# EAGLE design circuit (EAGLE 9.0.0)
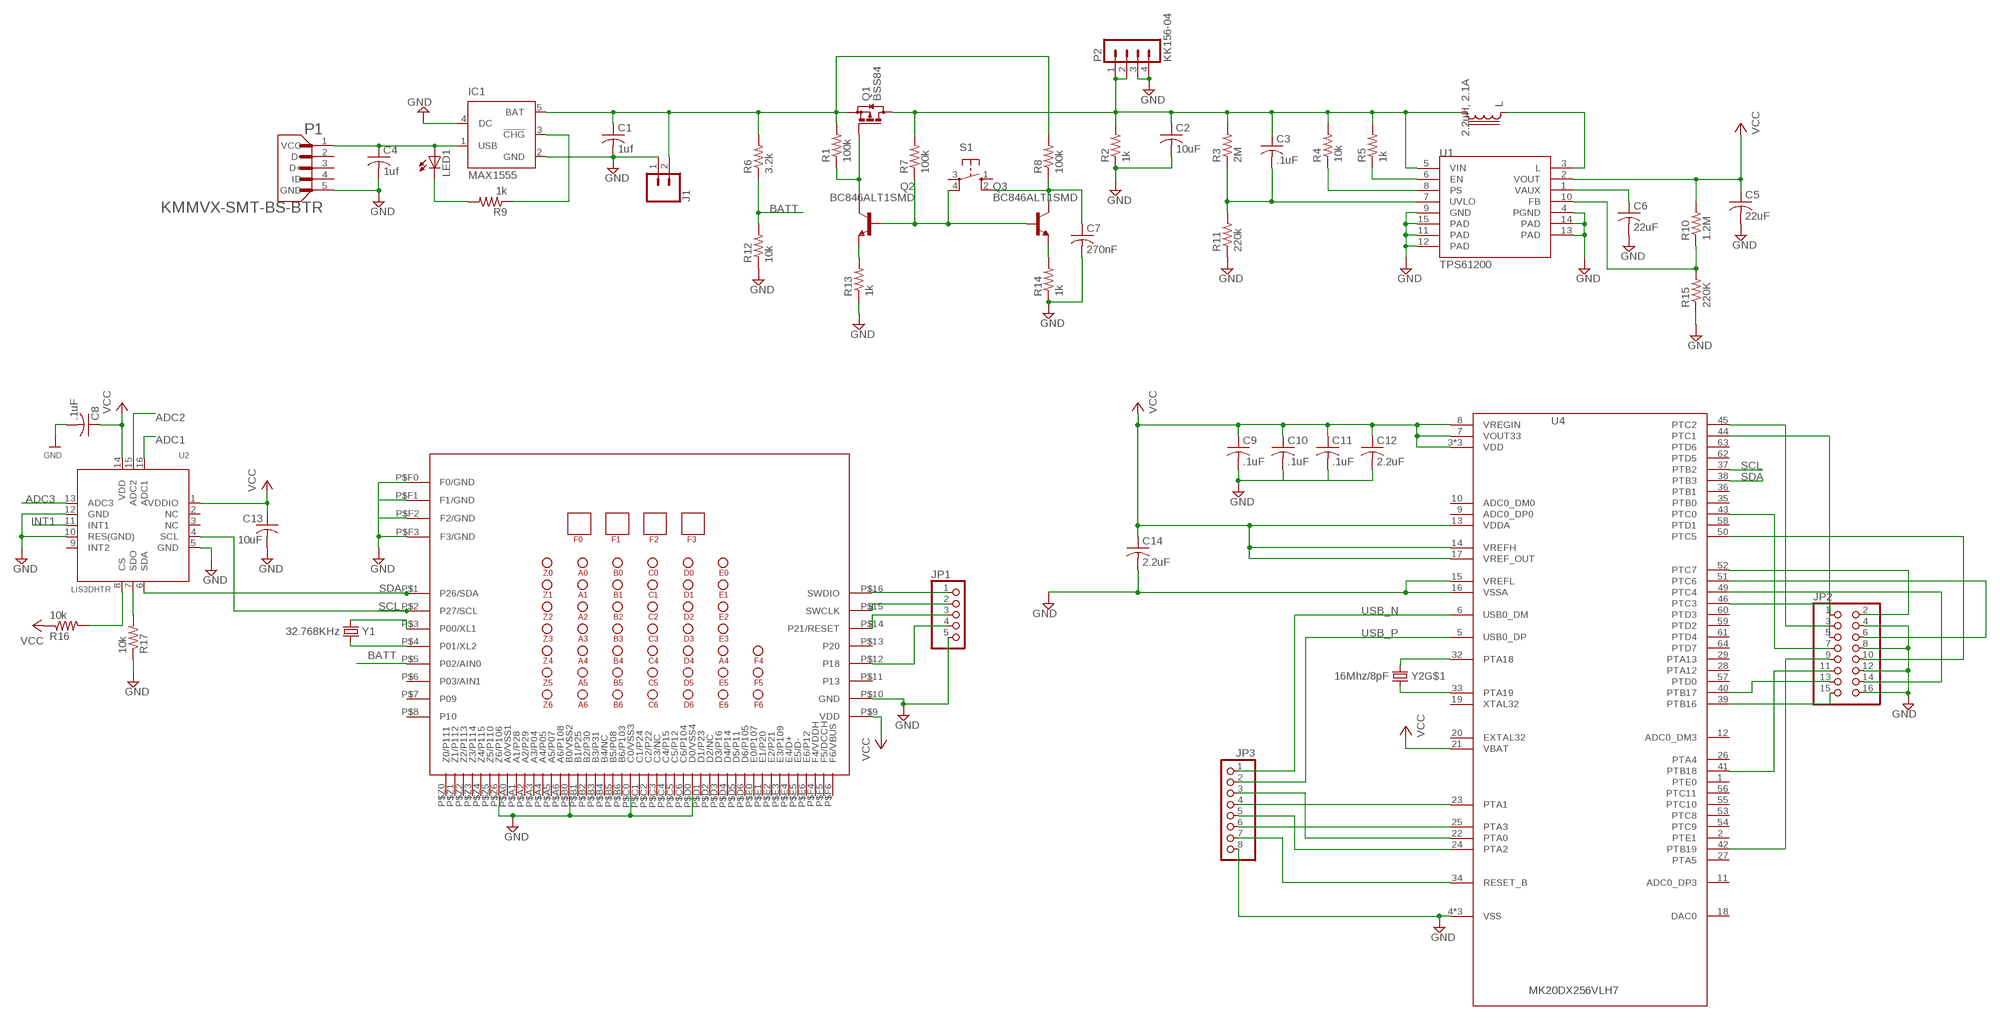
[diagram p0: schematic, sheet 1]

## Parts
C1  1uf  C-USC0402  [C0402]
C2  10uF  C-USC0402  [C0402]
C3  .1uF  C-USC0402  [C0402]
C4  1uf  C-USC0402  [C0402]
C5  22uF  C-USC0402  [C0402]
C6  22uF  C-USC0402  [C0402]
C7  270nF  C-USC0402  [C0402]
C8  .1uF  C-USC0402  [C0402]
C9  .1uF  C-USC0402  [C0402]
C10  .1uF  C-USC0402  [C0402]
C11  .1uF  C-USC0402  [C0402]
C12  2.2uF  C-USC0402  [C0402]
C13  10uF  C-USC0402  [C0402]
C14  2.2uF  C-USC0402  [C0402]
IC1  MAX1555  [SOT23-5L]
J1  CONN_02-JST-2-PTH-NO_SILK  [JST-2-PTH-NS]
JP1  PINHD-1X5  [1X05]
JP2  PINHD-2X8  [2X08]
JP3  PINHD-1X8  [1X08]
L  2.2uH, 2.1A  LPS30152.2UH  [LPS3015]
LED1  LEDSML0805  [SML0805]
P1  KMMVX-SMT-BS-BTR  [KYCON_KMMVX-SMT-BS-BTR]
P2  KK156-04  [KK156-04]
Q1  BSS84  [SOT23]
Q2  BC846ALT1SMD  [SOT23]
Q3  BC846ALT1SMD  [SOT23]
R1  100k  R-US_R0402  [R0402]
R2  1k  R-US_R0402  [R0402]
R3  2M  R-US_R0402  [R0402]
R4  10k  R-US_R0402  [R0402]
R5  1k  R-US_R0402  [R0402]
R6  3.2k  R-US_R0402  [R0402]
R7  100k  R-US_R0402  [R0402]
R8  100k  R-US_R0402  [R0402]
R9  1k  R-US_R0402  [R0402]
R10  1.2M  R-US_R0402  [R0402]
R11  220k  R-US_R0402  [R0402]
R12  10k  R-US_R0402  [R0402]
R13  1k  R-US_R0402  [R0402]
R14  1k  R-US_R0402  [R0402]
R15  220K  R-US_R0402  [R0402]
R16  10k  R-US_R0402  [R0402]
R17  10k  R-US_R0402  [R0402]
S1  10-XX  [B3F-10XX]
U1  TPS61200  [QFN-10_PAD]
U2  LIS3DHTR  ACCEL_LIS3DHTR  [LGA16_3X3MM]
U3  BT840  [BT840]
U4  MK20DX256VLH7  [MK20DX256VLH7]
Y1  32.768KHz  CRYSTAL/32.768KHZ/SMD-TXC_7A  [CRYSTAL-TXC-7A]
Y2  16Mhz/8pF  CRYSTAL/SMD-5X3-GND16MHZ/8PF  [CRYSTAL-SMD-5X3]

## Nets
ADC1: U2.16(ADC1)
ADC2: U2.15(ADC2)
ADC3: U2.13(ADC3)
BATT: R6.1 R12.2 U3.P$5(P02/AIN0)
GND: C1.2 C2.2 C4.2 C5.2 C6.2 C7.2 C8.2 C9.2 C10.2 C13.2 C14.2 IC1.2(GND) IC1.4(DC) J1.1 JP1.5 JP2.4 JP2.8 JP2.12 JP2.16 JP3.8 P1.5(GND) P2.3 P2.4 R2.1 R11.1 R12.1 R13.1 R14.1 R15.1 R17.1 U1.4(PGND) U1.9(GND) U1.11(PAD) U1.12(PAD) U1.13(PAD) U1.14(PAD) U1.15(PAD) U2.5(GND) U2.10(RES(GND)) U2.12(GND) U3.P$10(GND) U3.P$B0(B0/VSS2) U3.P$C0(C0/VSS3) U3.P$D0(D0/VSS4) U3.P$F0(F0/GND) U3.P$F1(F1/GND) U3.P$F2(F2/GND) U3.P$F3(F3/GND) U3.P$Z6(Z6/P106) U4.4(VSS) U4.15(VREFL) U4.16(VSSA) U4.31(VSS) U4.47(VSS)
GND1: C11.2
GND2: C12.2
INT1: U2.11(INT1)
N$1: Q1.1(G) Q2.3(C) R1.1
N$2: C7.1 Q3.3(C) R8.1 S1.2(S1)
N$3: Q2.2(E) R13.2
N$4: Q2.1(B) Q3.1(B) R7.1 S1.4(P1)
N$5: Q3.2(E) R14.2
N$6: JP2.1 U4.46(PTC3)
N$7: U3.P$3(P00/XL1) Y1.P$2
N$8: C4.1 IC1.1(USB) LED1.A P1.1(VCC)
N$9: R16.2 U2.8(CS)
N$10: IC1.3(!CHG) R9.1
N$11: LED1.C R9.2
N$12: R17.2 U2.7(SDO)
N$13: L.1 U1.3(L)
N$14: JP3.3 U4.22(PTA0)
N$15: U3.P$4(P01/XL2) Y1.P$1
N$16: C3.2 R3.1 R11.2 U1.7(UVLO)
N$17: R4.1 U1.8(PS)
N$18: JP3.4 U4.23(PTA1)
N$19: R5.1 U1.6(EN)
N$20: C6.1 U1.1(VAUX)
N$21: JP3.5 U4.24(PTA2)
N$22: R10.1 R15.2 U1.10(FB)
N$23: JP3.6 U4.25(PTA3)
N$24: JP3.7 U4.34(RESET_B)
N$25: JP1.1 U3.P$16(SWDIO)
N$26: JP1.2 U3.P$15(SWCLK)
N$27: U4.32(PTA18) Y2.3
N$28: U4.33(PTA19) Y2.1
N$29: JP1.3 U3.P$14(P21/RESET)
N$30: JP1.4 U3.P$12(P18)
N$31: C1.1 IC1.5(BAT) J1.2 Q1.2(S) R1.2 R6.2 R8.2
N$32: JP2.3 U4.45(PTC2)
N$33: JP2.5 U4.44(PTC1)
N$34: JP2.7 U4.43(PTC0)
N$35: JP2.9 U4.42(PTB19)
N$36: JP2.11 U4.41(PTB18)
N$37: JP2.13 U4.40(PTB17)
N$38: JP2.15 U4.39(PTB16)
N$39: JP2.14 U4.49(PTC4)
N$40: JP2.10 U4.50(PTC5)
N$41: JP2.6 U4.51(PTC6)
N$42: JP2.2 U4.52(PTC7)
SCL: U2.4(SCL) U3.P$2(P27/SCL) U4.37(PTB2)
SDA: U2.6(SDA) U3.P$1(P26/SDA) U4.38(PTB3)
USB_N: JP3.1 U4.6(USB0_DM)
USB_P: JP3.2 U4.5(USB0_DP)
VCC: C5.1 C8.1 C9.1 C10.1 C11.1 C12.1 C13.1 C14.1 R10.2 R16.1 U1.2(VOUT) U2.1(VDDIO) U2.14(VDD) U3.P$9(VDD) U4.3(VDD) U4.7(VOUT33) U4.8(VREGIN) U4.13(VDDA) U4.14(VREFH) U4.17(VREF_OUT) U4.21(VBAT) U4.30(VDD) U4.48(VDD)
VIN: C2.1 C3.1 L.2 P2.1 P2.2 Q1.3(D) R2.2 R3.2 R4.2 R5.2 R7.2 U1.5(VIN)
Unconnected: P1.2(D-) P1.3(D+) P1.4(ID) S1.1(S) S1.3(P) U2.2(NC) U2.3(NC) U2.9(INT2) U3.P$6(P03/AIN1) U3.P$7(P09) U3.P$8(P10) U3.P$11(P13) U3.P$13(P20) U3.P$A0(A0/VSS1) U3.P$A1(A1/P28) U3.P$A2(A2/P29) U3.P$A3(A3/P04) U3.P$A4(A4/P05) U3.P$A5(A5/P07) U3.P$A6(A6/P108) U3.P$B1(B1/P25) U3.P$B2(B2/P30) U3.P$B3(B3/P31) U3.P$B4(B4/NC) U3.P$B5(B5/P08) U3.P$B6(B6/P103) U3.P$C1(C1/P24) U3.P$C2(C2/P22) U3.P$C3(C3/NC) U3.P$C4(C4/P15) U3.P$C5(C5/P12) U3.P$C6(C6/P104) U3.P$D1(D1/P23) U3.P$D2(D2/NC) U3.P$D3(D3/P16) U3.P$D4(D4/P14) U3.P$D5(D5/P11) U3.P$D6(D6/P105) U3.P$E0(E0/P107) U3.P$E1(E1/P20) U3.P$E2(E2/P21) U3.P$E3(E3/P109) U3.P$E4(E4/D+) U3.P$E5(E5/D-) U3.P$E6(E6/P12) U3.P$F4(F4/VDDH) U3.P$F5(F5/DCCH) U3.P$F6(F6/VBUS) U3.P$Z0(Z0/P111) U3.P$Z1(Z1/P112) U3.P$Z2(Z2/P113) U3.P$Z3(Z3/P114) U3.P$Z4(Z4/P115) U3.P$Z5(Z5/P110) U4.1(PTE0) U4.2(PTE1) U4.9(ADC0_DP0) U4.10(ADC0_DM0) U4.11(ADC0_DP3) U4.12(ADC0_DM3) U4.18(DAC0) U4.19(XTAL32) U4.20(EXTAL32) U4.26(PTA4) U4.27(PTA5) U4.28(PTA12) U4.29(PTA13) U4.35(PTB0) U4.36(PTB1) U4.53(PTC8) U4.54(PTC9) U4.55(PTC10) U4.56(PTC11) U4.57(PTD0) U4.58(PTD1) U4.59(PTD2) U4.60(PTD3) U4.61(PTD4) U4.62(PTD5) U4.63(PTD6) U4.64(PTD7) Y2.2(GND:GND) Y2.4(GND:GND)

## Library data of the parts
C1-C6 C8-C14 = rcl:C-US: CAPACITOR, American symbol; OC_NEWARK: unknown; SPICEPREFIX: C
C7 = rcl:C-US: CAPACITOR, American symbol; MPN: C1206C274K1RACTU; OC_NEWARK: 07X1025; SPICEPREFIX: C
IC1 = maxim:MAX1555: Dual-Input USB/AC Adapter 1-Cell Li+ Battery Chargers Source: http://www.maxim-ic.com .. MAX1551-MAX1555.pdf; MF: MAXIM; MPN: MAX1555EZK+T; OC_FARNELL: 1628222; OC_NEWARK: unknown
J1 = SparkFun-Connectors:CONN_02: Multi connection point. Often used as Generic Header-pin footprint for 0.1 inch spaced/style header connections On any of the 0.1 inch spaced packages, you can populate with these: Break Away Headers - Straight <https://www.sparkfun.com/products/116> (PRT-00116) Break Away Male Headers - Right Angle <https://www.sparkfun.com/products/553> (PRT-00553) Female Headers <https://www.sparkfun.com/products/115> (PRT-00115) Break Away Headers - Machine Pin <https://www.sparkfun.com/products/117> (PRT-00117) Break Away Female Headers - Swiss Machine Pin <https://www.sparkfun.com/products/743> (PRT-00743) For SCREWTERMINALS and SPRING TERMINALS visit here: Screw Terimnals on SparkFun.com <https://www.sparkfun.com/search/results?term=Screw+Terminals> (5mm/3.5mm/2.54mm spacing) This device is also useful as a general connection point to wire up your design to another part of your project. Our various solder wires solder well into these plated through hole pads. Hook-Up Wire - Assortment (Stranded, 22 AWG) <https://www.sparkfun.com/products/11375> (PRT-11375) Hook-Up Wire - Assortment (Solid Core, 22 AWG) <https://www.sparkfun.com/products/11367> (PRT-11367) View the entire wire category on our website here <https://www.sparkfun.com/categories/141> Special notes: Molex polarized connector foot print use with: PRT-08233 with associated crimp pins and housings. 2.54_SCREWTERM for use with PRT-10571. 3.5mm Screw Terminal footprints for PRT-08084 5mm Screw Terminal footprints for use with PRT-08432
JP1 = pinhead:PINHD-1X5: PIN HEADER; OC_NEWARK: unknown
JP2 = pinhead:PINHD-2X8: PIN HEADER; OC_NEWARK: unknown
JP3 = pinhead:PINHD-1X8: PIN HEADER; OC_NEWARK: unknown
L = appfruits:LPS3015: Shielded Power Inductor; OC_NEWARK: unknown
LED1 = led:LED: LED OSRAM: - CHIPLED LG R971, LG N971, LY N971, LG Q971, LY Q971, LO R971, LY R971 LH N974, LH R974 LS Q976, LO Q976, LY Q976 LO Q996 - Hyper CHIPLED LW Q18S LB Q993, LB Q99A, LB R99A - SideLED LS A670, LO A670, LY A670, LG A670, LP A670 LB A673, LV A673, LT A673, LW A673 LH A674 LY A675 LS A676, LA A676, LO A676, LY A676, LW A676 LS A679, LY A679, LG A679 - Hyper Micro SIDELED® LS Y876, LA Y876, LO Y876, LY Y876 LT Y87S - SmartLED LW L88C, LW L88S LB L89C, LB L89S, LG L890 LS L89K, LO L89K, LY L89K LS L896, LA L896, LO L896, LY L896 - TOPLED LS T670, LO T670, LY T670, LG T670, LP T670 LSG T670, LSP T670, LSY T670, LOP T670, LYG T670 LG T671, LOG T671, LSG T671 LB T673, LV T673, LT T673, LW T673 LH T674 LS T676, LA T676, LO T676, LY T676, LB T676, LH T676, LSB T676, LW T676 LB T67C, LV T67C, LT T67C, LS T67K, LO T67K, LY T67K, LW E67C LS E67B, LA E67B, LO E67B, LY E67B, LB E67C, LV E67C, LT E67C LW T67C LS T679, LY T679, LG T679 LS T770, LO T770, LY T770, LG T770, LP T770 LB T773, LV T773, LT T773, LW T773 LH T774 LS E675, LA E675, LY E675, LS T675 LS T776, LA T776, LO T776, LY T776, LB T776 LHGB T686 LT T68C, LB T68C - Hyper Mini TOPLED® LB M676 - Mini TOPLED Santana® LG M470 LS M47K, LO M47K, LY M47K Source: http://www.osram.convergy.de LUXEON: - LUMILED® LXK2-PW12-R00, LXK2-PW12-S00, LXK2-PW14-U00, LXK2-PW14-V00 LXK2-PM12-R00, LXK2-PM12-S00, LXK2-PM14-U00 LXK2-PE12-Q00, LXK2-PE12-R00, LXK2-PE12-S00, LXK2-PE14-T00, LXK2-PE14-U00 LXK2-PB12-K00, LXK2-PB12-L00, LXK2-PB12-M00, LXK2-PB14-N00, LXK2-PB14-P00, LXK2-PB14-Q00 LXK2-PR12-L00, LXK2-PR12-M00, LXK2-PR14-Q00, LXK2-PR14-R00 LXK2-PD12-Q00, LXK2-PD12-R00, LXK2-PD12-S00 LXK2-PH12-R00, LXK2-PH12-S00 LXK2-PL12-P00, LXK2-PL12-Q00, LXK2-PL12-R00 Source: www.luxeon.com KINGBRIGHT: KA-3528ASYC Source: www.kingbright.com; OC_NEWARK: unknown
P1 = KMMVX-SMT-BS-BTR:KMMVX-SMT-BS-BTR: Micro-B Socket, USB 2.0 SMT; AVAILABILITY: Good; DESCRIPTION: Conn Micro USB Type B SKT 5 POS 0.65mm Solder ST SMD 5 Terminal 1Port T/R; MF: Kycon; MP: KMMVX-SMT-BS-BTR; PACKAGE: None; PRICE: 0.88 USD
P2 = con-molex-kk:KK156-04: HEADER
Q1 = transistor-small-signal:BSS84: P-CHANNEL MOS FET; OC_NEWARK: unknown
Q2 Q3 = transistor-npn:BC846*: NPN Transistor; OC_NEWARK: unknown
R1-R17 = resistor:R-US_: RESISTOR, American symbol; OC_NEWARK: unknown
S1 = switch-omron:10-XX: OMRON SWITCH; MPN: B3F-1000; OC_FARNELL: 176432; OC_NEWARK: unknown
U1 = appfruits:TPS61200: DC to DC Booster IC-10035; OC_NEWARK: unknown; PROD_ID: IC-10035
U2 = microbuilder:ACCEL_LIS3DHTR: LIS3DHTR 3-Axis Accelerometer with I2C/SPI Interface VDD: 1.71-3.6V VDDIO: 1.71-VDD+0.1V Scale: +/-2g, 4g, 8g, 16g with 16--bit data output Temp:: -40°C - 85°C Mouser: 511-LIS3DHTR Digikey: 497-10613-1-ND; OC_NEWARK: unknown
U3 = BT840:BT840; OC_NEWARK: unknown
U4 = appfruits:MK20DX256VLH7; OC_NEWARK: unknown
Y1 = appfruits:CRYSTAL/32.768KHZ/SMD-TXC_7A; OC_NEWARK: unknown
Y2 = appfruits:CRYSTAL/SMD-5X3-GND; OC_NEWARK: unknown

## Net classes
0 default: width 0.203 mm, clearance 0.152 mm
1 USB: width 0.254 mm, drill 0.33 mm, clearance 0.159 mm
2 Top GND Pour: clearance 0.762 mm to class 1

## Board
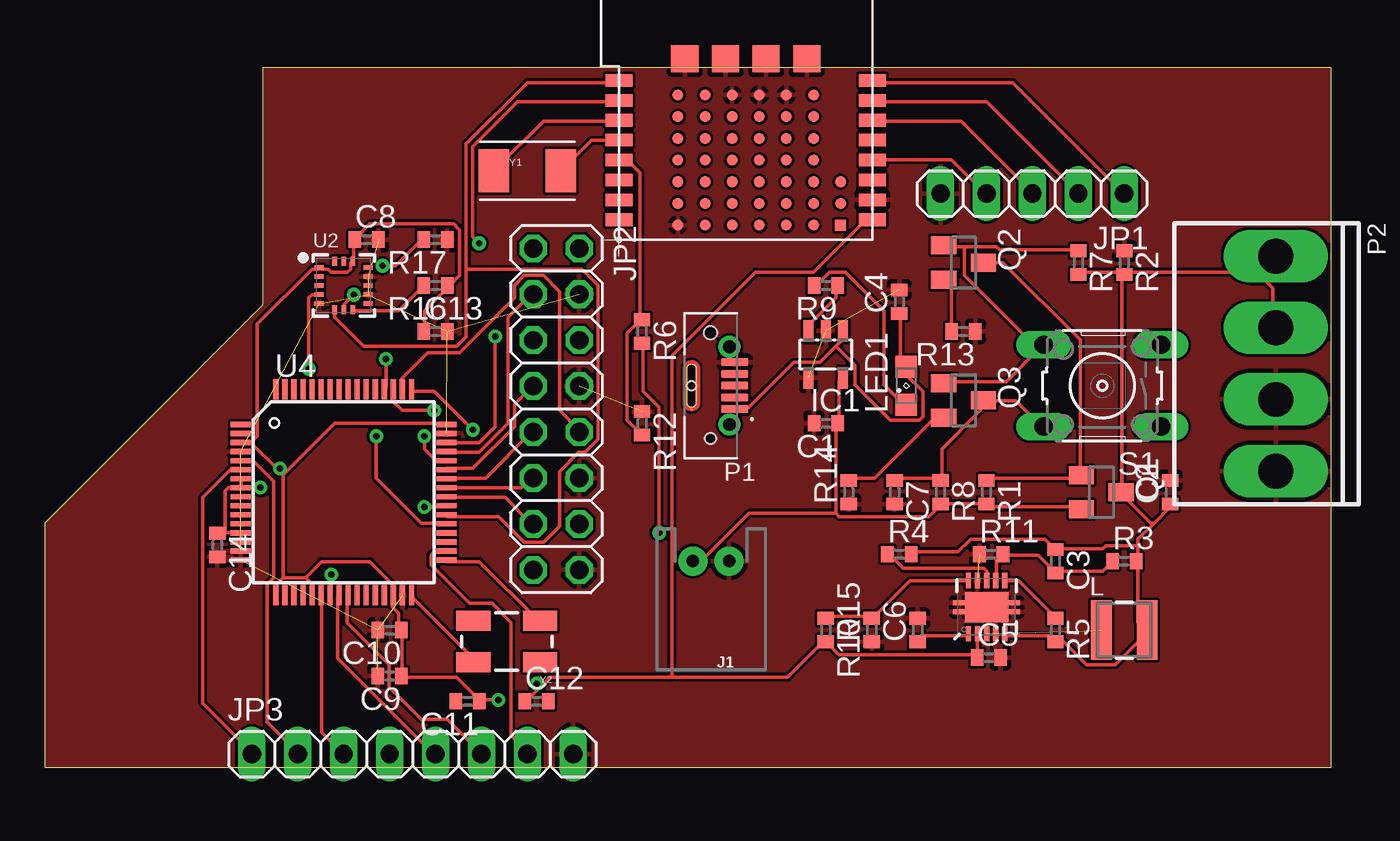
[diagram p1: board, top side]
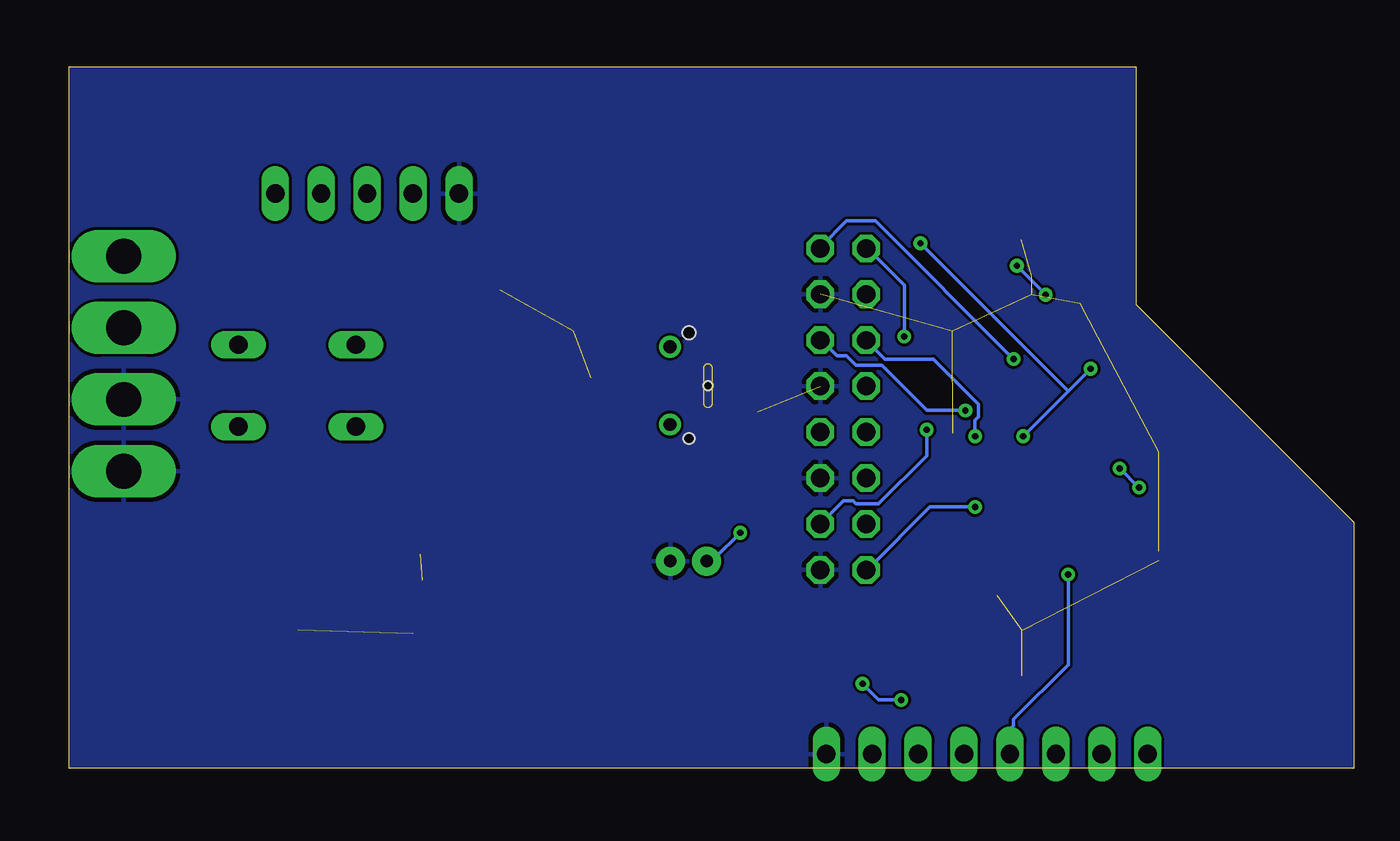
[diagram p2: board, bottom side, seen from below]

Size 71.12 x 38.73 mm. Coordinates in mm from the lower left corner, seen from the top.
Outline: 0,0 0,13.54 12.07,25.61 12.07,38.73 71.12,38.73 71.12,0 0,0
Copper layers (1*16): Top 0.035mm / dielectric 1.5mm / Bottom 0.035mm
Design rules "default *": minimum track width 6mil, minimum drill 0.35mm, track to track 6mil, track to pad 6mil, pad to pad 6mil, via to via 6mil, smd to smd 6mil, copper to edge 2mil, drill to drill 6mil, minimum pad ring 10mil, minimum via ring 8mil, stop-mask expansion 4mil, vias tented up to drill 0mil, thermal gap 10mil

### Footprints (pad centres in the part's own frame; a part is rotated, then mirrored left to right if it is on the bottom)
C0402 = smd 0.7 x 0.9: 1 -0.65,0; 2 0.65,0
SOT23-5L = smd 0.55 x 1.2: 1 -0.95,-1.3; 2 0,-1.3; 3 0.95,-1.3; 4 0.95,1.3; 5 -0.95,1.3
JST-2-PTH-NS = drill 0.7 pad 1.6: 1 -1,0; 2 1,0
1X05 = drill 1.016 long: 1 -5.08,0; 2 -2.54,0; 3 0,0; 4 2.54,0; 5 5.08,0
2X08 = drill 1.016 octagon: 1 -8.89,-1.27; 2 -8.89,1.27; 3 -6.35,-1.27; 4 -6.35,1.27; 5 -3.81,-1.27; 6 -3.81,1.27; 7 -1.27,-1.27; 8 -1.27,1.27; 9 1.27,-1.27; 10 1.27,1.27; 11 3.81,-1.27; 12 3.81,1.27; 13 6.35,-1.27; 14 6.35,1.27; 15 8.89,-1.27; 16 8.89,1.27
1X08 = drill 1.016 long: 1 -8.89,0; 2 -6.35,0; 3 -3.81,0; 4 -1.27,0; 5 1.27,0; 6 3.81,0; 7 6.35,0; 8 8.89,0
LPS3015 = smd 1.14 x 3.3: 1 -1.27,0; 2 1.27,0
SML0805 = smd 1.2 x 1.2: A 1.05,0; C -1.05,0
KYCON_KMMVX-SMT-BS-BTR = smd 0.45 x 1.5: 1 -1.3,-1.35; 2 -0.65,-1.35; 3 0,-1.35; 4 0.65,-1.35; 5 1.3,-1.35 | drill 0.7 pad 1: P1 -2.15,-1.05; P2 2.15,-1.05 | smd 0.1 x 0.1: P3 -1.3,1.05 | hole 0.6: -2.925,0 | hole 0.75: 2.925,0 | hole 0.5: 0,1.05
KK156-04 = drill 1.93 long: 1 -5.944,0; 2 -1.981,0; 3 1.981,0; 4 5.944,0
SOT23 = smd 1 x 1.4: 1 -0.95,-1.1; 2 0.95,-1.1; 3 0,1.1
R0402 = smd 0.7 x 0.9: 1 -0.65,0; 2 0.65,0
B3F-10XX = drill 1.016 long: 1 -3.251,2.261; 2 3.251,2.261; 3 -3.251,-2.261; 4 3.251,-2.261
QFN-10_PAD = smd 0.297 x 0.85: 1 -1,-1.475; 2 -0.5,-1.475; 3 0,-1.475; 4 0.5,-1.475; 5 1,-1.475; 6 1,1.475; 7 0.5,1.475; 8 0,1.475; 9 -0.5,1.475; 10 -1,1.475 | smd 0.7 x 0.28: 11 -1.5,0.25; 12 -1.5,-0.25; 13 1.5,0.25; 14 1.5,-0.25 | smd 2.4 x 1.65: 15 0,0
LGA16_3X3MM = smd 0.5 x 0.25: 1 -1.35,1; 2 -1.35,0.5; 3 -1.35,0; 4 -1.35,-0.5; 5 -1.35,-1; 9 1.35,-1; 10 1.35,-0.5; 11 1.35,0; 12 1.35,0.5; 13 1.35,1 | smd 0.25 x 0.5: 6 -0.5,-1.35; 7 0,-1.35; 8 0.5,-1.35; 14 0.5,1.35; 15 0,1.35; 16 -0.5,1.35
BT840 = smd 1.5 x 0.7: P$1 0,8.8; P$2 0,7.7; P$3 0,6.6; P$4 0,5.5; P$5 0,4.4; P$6 0,3.3; P$7 0,2.2; P$8 0,1.1; P$9 14,1.1; P$10 14,2.2; P$11 14,3.3; P$12 14,4.4; P$13 14,5.5; P$14 14,6.6; P$15 14,7.7; P$16 14,8.8 | smd 0.6 x 0.6: P$A0 4.75,8; P$A1 4.75,6.8; P$A2 4.75,5.6; P$A3 4.75,4.4; P$A4 4.75,3.2; P$A5 4.75,2; P$A6 4.75,0.8; P$B0 6.25,8; P$B1 6.25,6.8; P$B2 6.25,5.6; P$B3 6.25,4.4; P$B4 6.25,3.2; P$B5 6.25,2; P$B6 6.25,0.8; P$C0 7.75,8; P$C1 7.75,6.8; P$C2 7.75,5.6; P$C3 7.75,4.4; P$C4 7.75,3.2; P$C5 7.75,2; P$C6 7.75,0.8; P$D0 9.25,8; P$D1 9.25,6.8; P$D2 9.25,5.6; P$D3 9.25,4.4; P$D4 9.25,3.2; P$D5 9.25,2; P$D6 9.25,0.8; P$E0 10.75,8; P$E1 10.75,6.8; P$E2 10.75,5.6; P$E3 10.75,4.4; P$E4 10.75,3.2; P$E5 10.75,2; P$E6 10.75,0.8; P$F4 12.25,3.2; P$F5 12.25,2; P$F6 12.25,0.8; P$Z0 3.25,8; P$Z1 3.25,6.8; P$Z2 3.25,5.6; P$Z3 3.25,4.4; P$Z4 3.25,3.2; P$Z5 3.25,2; P$Z6 3.25,0.8 | smd 1.5 x 1.5: P$F0 3.63,10; P$F1 5.88,10; P$F2 8.13,10; P$F3 10.38,10
MK20DX256VLH7 = smd 1.1 x 0.285: 1 -5.7,3.75; 2 -5.7,3.25; 3 -5.7,2.75; 4 -5.7,2.25; 5 -5.7,1.75; 6 -5.7,1.25; 7 -5.7,0.75; 8 -5.7,0.25; 9 -5.7,-0.25; 10 -5.7,-0.75; 11 -5.7,-1.25; 12 -5.7,-1.75; 13 -5.7,-2.25; 14 -5.7,-2.75; 15 -5.7,-3.25; 16 -5.7,-3.75; 33 5.7,-3.75; 34 5.7,-3.25; 35 5.7,-2.75; 36 5.7,-2.25; 37 5.7,-1.75; 38 5.7,-1.25; 39 5.7,-0.75; 40 5.7,-0.25; 41 5.7,0.25; 42 5.7,0.75; 43 5.7,1.25; 44 5.7,1.75; 45 5.7,2.25; 46 5.7,2.75; 47 5.7,3.25; 48 5.7,3.75 | smd 0.285 x 1.1: 17 -3.75,-5.7; 18 -3.25,-5.7; 19 -2.75,-5.7; 20 -2.25,-5.7; 21 -1.75,-5.7; 22 -1.25,-5.7; 23 -0.75,-5.7; 24 -0.25,-5.7; 25 0.25,-5.7; 26 0.75,-5.7; 27 1.25,-5.7; 28 1.75,-5.7; 29 2.25,-5.7; 30 2.75,-5.7; 31 3.25,-5.7; 32 3.75,-5.7; 49 3.75,5.7; 50 3.25,5.7; 51 2.75,5.7; 52 2.25,5.7; 53 1.75,5.7; 54 1.25,5.7; 55 0.75,5.7; 56 0.25,5.7; 57 -0.25,5.7; 58 -0.75,5.7; 59 -1.25,5.7; 60 -1.75,5.7; 61 -2.25,5.7; 62 -2.75,5.7; 63 -3.25,5.7; 64 -3.75,5.7
CRYSTAL-TXC-7A = smd 1.7 x 2.4: P$1 1.85,0; P$2 -1.85,0
CRYSTAL-SMD-5X3 = smd 1.9 x 1.1: 1 -1.85,-1.15; 2 1.85,-1.15; 3 1.85,1.15; 4 -1.85,1.15

### Placement (x,y rotation side)
C1  43.18,19.05 180 top
C2  62.23,15.24 90 top
C3  55.88,11.43 270 top
C4  47.24,25.78 90 top
C5  52.2,6.1 0 top
C6  48.26,7.62 90 top
C7  46.99,15.24 270 top
C8  17.78,29.21 0 top
C9  19.05,5.08 180 top
C10  19.05,7.62 180 top
C11  23.37,3.68 180 top
C12  27.18,3.68 0 top
C13  21.59,24.13 0 top
C14  9.53,12.32 270 top
IC1  43.18,22.86 180 top
J1  36.83,11.43 180 top
JP1  54.61,31.75 180 top
JP2  28.27,19.84 270 top
JP3  20.32,0.76 0 top
L  59.69,7.62 0 top
LED1  47.62,21.13 90 top
P1  36.8,21.13 90 top
P2  68.07,22.35 270 top
Q1  58.42,15.24 270 top
Q2  50.8,27.94 270 top
Q3  50.8,20.32 270 top
R1  52.07,15.24 270 top
R2  59.69,27.94 270 top
R3  59.69,11.43 0 top
R4  47.24,11.81 0 top
R5  55.88,7.62 270 top
R6  33.02,24.13 270 top
R7  57.15,27.94 270 top
R8  49.53,15.24 270 top
R9  43.18,26.67 180 top
R10  43.18,7.62 270 top
R11  52.32,11.81 0 top
R12  33.02,19.05 270 top
R13  50.8,24.13 180 top
R14  44.45,15.24 90 top
R15  45.72,7.62 90 top
R16  21.59,26.67 180 top
R17  21.59,29.21 180 top
S1  58.47,21.13 180 top
U1  52.07,8.89 0 top
U2  16.51,26.67 0 top
U3  31.75,29.21 0 top
U4  16.51,15.24 0 top
Y1  26.67,33.02 0 top
Y2  25.53,6.99 180 top

### Tracks (layer width: path | path; a pad name or v marks a point on that pad's centre or on a via)
BATT
  Top 0.203: R12.2 32.89,18.52 32.18,19.23 32.18,24.03 32.89,24.74 R6.1 32.89,24.92 32.89,32.92 32.36,33.45 31.83,33.45 U3.P$5
GND  (15 unrouted)
  pour Top: 12.06,38.73 12.06,25.78 0,13.72 0,-0.13 71.25,-0.13 71.25,38.73
  pour Bottom: 12.06,38.86 11.94,38.73 11.94,25.91 -0.13,13.84 -0.13,-0.25 -0.25,-0.38 50.93,-0.38 71.37,-0.51 71.37,38.73 50.93,38.86
N$1
  Top 0.203: R1.1 52.09,16.03 57.25,16.03 Q1.1 57.25,16.2 57.25,23.67 52.98,27.94 Q2.3
N$2
  Top 0.203: C7.1 47.12,16.03 49.43,16.03 R8.1 49.61,16.03 49.61,17.63 51.74,19.76 51.74,20.29 Q3.3 51.92,20.29 53.7,20.29 55.12,18.87 S1.2
N$3
  Top 0.203: R13.2 50.14,24.21 50.14,26.52 49.78,26.87 Q2.2
N$4
  Top 0.203: 50.85,28.83 49.78,28.83 Q2.1 | 50.85,28.83 52.63,28.83 52.81,28.65 57.07,28.65 R7.1 | 54.94,23.14 55.12,23.32 S1.4 54.94,23.14 | 54.94,23.14 53.16,21.36 49.78,21.36 Q3.1 | 50.85,28.83 50.85,27.23 54.94,23.14
N$5
  Top 0.203: R14.2 44.45,16.03 45.87,16.03 49.07,19.23 49.61,19.23 Q3.2
N$6  (via drill 0.35)
  Top 0.203: v24.89,23.85 24.89,18.87 24,17.98 22.23,17.98 U4.46
  Bottom 0.203: v24.89,23.85 24.89,26.69 26.85,28.65 JP2.1
N$7
  Top 0.203: U3.P$3 31.65,35.76 27.56,35.76 24.89,33.1 Y1.P$2
N$8
  Top 0.203: C4.1 47.3,25.1 47.3,22.43 47.47,22.25 LED1.A 47.65,22.07 47.65,21.72 48.54,20.83 48.54,19.41 48.36,19.23 46.76,19.23 44.81,21.18 44.81,22.25 43.74,23.32 | 43.74,23.32 42.85,22.43 41.43,22.43 38.94,19.94 38.23,19.94 P1.1 | 43.74,23.32 44.09,23.67 44.09,24.03 IC1.1
N$9
  Top 0.203: U2.8 17.07,25.27 19.56,25.27 20.8,26.52 R16.2
N$10
  Top 0.203: R9.1 43.74,26.52 43.74,25.98 42.32,24.56 42.32,24.21 IC1.3
N$11
  Top 0.203: R9.2 42.67,26.69 43.38,27.41 44.27,27.41 46.41,25.27 46.41,21.18 47.47,20.12 LED1.C
N$12  (via drill 0.35)
  Top 0.203: v17.07,26.16 16.54,25.63 16.54,25.45 U2.7 | v18.67,27.76 19.38,27.76 20.8,29.18 R17.2
  Bottom 0.203: v18.67,27.76 v17.07,26.16
N$13  (1 unrouted)
N$14
  Top 0.203: JP3.3 15.29,1.98 15.29,9.45 U4.22
N$15
  Top 0.203: U3.P$4 31.65,34.7 30.23,34.7 28.63,33.1 Y1.P$1
N$16
  Top 0.203: U1.7 52.63,10.52 52.63,11.58 52.81,11.76 R11.2 52.98,11.76 54.94,11.76 55.83,10.87 C3.2 56.01,10.87 58.5,10.87 59.03,11.4 R3.1
N$17
  Top 0.203: U1.8 52.09,10.52 52.09,10.87 51.92,11.05 47.47,11.05 46.76,11.76 R4.1
N$18  (via drill 0.35)
  Top 0.203: v15.82,10.69 15.82,9.63 U4.23
  Bottom 0.203: v15.82,10.69 15.82,5.72 18.85,2.69 18.85,2.34 19.02,2.16 19.02,0.91 JP3.4
N$19
  Top 0.203: U1.6 53.16,10.34 53.87,10.34 55.83,8.38 R5.1
N$20
  Top 0.203: U1.1 51.03,7.32 48.54,7.32 48.36,7.14 C6.1
N$21
  Top 0.203: U4.24 16.18,9.45 16.18,6.07 21.51,0.74 JP3.5
N$22
  Top 0.203: U1.10 51.03,10.34 47.83,10.34 45.87,8.38 R15.2 45.7,8.38 43.2,8.38 R10.1
N$23
  Top 0.203: U4.25 16.71,9.45 16.71,8.03 19.02,5.72 19.02,4.47 20.8,2.69 22.23,2.69 24,0.91 JP3.6
N$24
  Top 0.203: U4.34 22.05,11.94 21.51,11.94 21.34,11.76 21.34,11.23 23.47,9.09 24.71,9.09 25.78,8.03 25.78,1.8 26.67,0.91 JP3.7
N$25
  Top 0.203: U3.P$16 45.87,37.9 53.52,37.9 59.56,31.85 JP1.1
N$26
  Top 0.203: U3.P$15 45.87,36.83 52.09,36.83 57.07,31.85 JP1.2
N$27
  Top 0.203: U4.32 20.27,9.45 23.82,5.89 Y2.3
N$28
  Top 0.203: U4.33 22.23,11.4 24,11.4 27.2,8.2 Y2.1
N$29
  Top 0.203: U3.P$14 45.87,35.76 50.67,35.76 54.59,31.85 JP1.3
N$30
  Top 0.203: U3.P$12 45.87,33.63 50.14,33.63 51.92,31.85 JP1.4
N$31  (via drill 0.35)
  Top 0.203: v33.96,13 33.96,19.94 33.07,20.83 33.07,23.32 R6.2 | IC1.5 44.09,21.54 43.92,21.36 43.92,19.05 C1.1 43.74,19.05 43.74,14.07 | Q1.2 57.25,14.43 52.09,14.43 R1.2 51.92,14.61 49.61,14.61 R8.2 49.43,14.43 48.9,13.89 43.92,13.89 43.74,14.07 | 43.74,14.07 38.94,14.07 36.45,11.58 35.92,11.58 J1.2
  Bottom 0.203: v33.96,13 35.38,11.58 35.74,11.58 J1.2
N$32
  Top 0.203: U4.45 22.23,17.45 24,17.45 25.6,19.05 25.6,24.92 26.85,26.16 JP2.3
N$33  (via drill 0.35)
  Top 0.203: v20.98,18.34 20.98,17.63 21.69,16.92 22.05,16.92 U4.44
  Bottom 0.203: v20.98,18.34 20.98,19.23 20.8,19.41 20.8,20.12 23.29,22.61 25.96,22.61 JP2.5
N$34
  Top 0.203: U4.43 22.23,16.56 23.65,16.56 25.96,18.87 25.96,20.12 26.85,21.01 JP2.7
N$35
  Top 0.203: U4.42 22.23,16.03 24.36,16.03 26.85,18.52 JP2.9
N$36
  Top 0.203: U4.41 22.23,15.49 26.31,15.49 26.85,16.03 JP2.11
N$37
  Top 0.203: U4.40 22.23,14.96 25.43,14.96 26.85,13.54 JP2.13
N$38  (via drill 0.35)
  Top 0.203: v20.98,14.43 22.05,14.43 U4.39
  Bottom 0.203: v20.98,14.43 23.47,14.43 26.85,11.05 JP2.15
N$39  (via drill 0.35)
  Top 0.203: v23.65,18.69 21.51,20.83 20.27,20.83 U4.49
  Bottom 0.203: v23.65,18.69 23.65,17.27 26.31,14.61 27.56,14.61 27.74,14.78 28.27,14.78 29.52,13.54 JP2.14
N$40
  Top 0.203: U4.50 19.74,21.01 19.74,21.54 21.16,22.96 22.94,22.96 25.96,25.98 25.96,26.69 26.49,27.23 27.56,27.23 28.45,26.34 28.45,19.76 29.52,18.69 JP2.10
N$41  (via drill 0.35)
  Top 0.203: v21.51,19.76 19.74,19.76 19.2,20.29 19.2,20.83 U4.51
  Bottom 0.203: v21.51,19.76 23.65,19.76 26.14,22.25 27.56,22.25 28.09,22.78 28.63,22.78 29.52,23.67 JP2.6
N$42  (via drill 0.35)
  Top 0.203: v18.85,22.61 18.85,21.01 U4.52
  Bottom 0.203: v18.85,22.61 26.49,30.25 28.09,30.25 29.52,28.83 JP2.2
SCL  (via drill 0.35)
  Top 0.203: v14.58,22.07 14.58,25.98 14.76,26.16 15.11,26.16 U2.4 | v18.31,18.34 18.31,16.03 20.8,13.54 22.05,13.54 U4.37 | v24,29.01 23.65,29.36 23.65,34.34 26.14,36.83 31.65,36.83 U3.P$2
  Bottom 0.203: v18.31,18.34 15.82,20.83 | 15.82,20.83 v14.58,22.07 | 15.82,20.83 v24,29.01
SDA
  Top 0.203: 23.29,27.58 23.29,34.52 26.67,37.9 31.65,37.9 U3.P$1 | 23.29,27.58 23.29,23.85 22.76,23.32 17.6,23.32 16,24.92 16,25.27 U2.6 | 23.29,27.58 29.69,27.58 30.58,26.69 30.58,18.16 29.87,17.45 29.52,17.45 28.45,16.38 28.45,13.36 27.56,12.47 26.49,12.47 25.07,13.89 22.23,13.89 U4.38
USB_N
  Top 0.203: U4.6 10.67,16.56 10.31,16.56 8.71,14.96 8.71,3.58 11.38,0.91 JP3.1
USB_P
  Top 0.203: U4.5 10.85,16.92 11.56,16.92 12.62,15.85 12.62,10.52 12.27,10.16 12.27,2.51 13.87,0.91 JP3.2
VCC  (via drill 0.35)
  Top 0.203: C13.1 20.98,24.21 20.98,25.27 22.23,26.52 R16.1 22.4,26.69 22.94,27.23 22.94,29.72 22.58,30.07 17.96,30.07 17.25,29.36 C8.1 17.07,29.18 17.07,28.12 U2.14 16.89,27.94 16.89,27.58 16.71,27.41 15.82,27.41 15.65,27.58 15.29,27.58 U2.1 15.11,27.58 14.76,27.58 11.73,24.56 11.73,18.34 11.38,17.98 | 10.85,15.49 10.85,15.85 U4.7 | 9.96,13 10.67,13 U4.13 10.85,13 10.85,12.47 U4.14 | 9.96,13 9.6,13 C14.1 9.96,13 | 9.96,13 9.96,15.32 10.13,15.49 10.67,15.49 U4.8 10.85,15.49 | 13.16,10.52 12.8,10.16 12.8,9.63 U4.17 | 14.4,10.52 13.16,10.52 | 14.4,10.52 14.76,10.16 14.76,9.63 U4.21 | 11.38,17.98 10.85,17.98 U4.3 | 13.16,16.2 12.8,16.56 | 12.8,16.56 11.38,17.98 | 13.16,10.52 13.16,16.2 | 13.16,16.2 16,19.05 22.05,19.05 U4.48 | v11.91,15.49 10.85,15.49 | 12.8,16.56 v12.98,16.56 | 14.4,10.52 15.29,11.4 17.96,11.4 19.2,10.16 19.2,9.63 U4.30 19.2,9.45 19.2,8.91 19.56,8.56 19.56,7.67 C10.1 19.74,7.49 19.74,5.18 C9.1 19.74,5 22.76,5 24,3.76 C11.1 24.18,3.76 v25.07,3.76 | U1.2 51.56,7.32 51.56,6.25 C5.1 51.38,6.25 43.92,6.25 43.2,6.96 R10.2 43.03,6.96 41.07,5 34.67,5 | 27.38,4.47 27.91,5 34.67,5 | 27.38,4.47 26.67,3.76 C12.1 | 34.67,5 34.67,22.78 39.29,27.41 42.49,27.41 45.34,30.25 45.7,30.25 U3.P$9 | 27.38,4.47 v27.2,4.65
  Bottom 0.203: v12.98,16.56 v11.91,15.49 | v25.07,3.76 26.31,3.76 v27.2,4.65
VIN
  Top 0.203: R4.2 48.01,11.94 50.49,11.94 51.21,12.65 55.3,12.65 55.83,12.12 C3.1 56.01,12.12 58.5,12.12 58.67,12.29 60.45,12.29 | 60.45,12.29 60.45,12.65 61.34,13.54 | 60.45,12.29 60.45,11.58 R3.2 60.45,11.4 60.45,8.03 60.81,7.67 L.2 60.98,7.49 59.21,5.72 57.61,5.72 56.36,6.96 56.01,6.96 R5.2 55.83,7.14 55.65,7.32 53.16,7.32 U1.5 | 61.34,13.54 62.23,14.43 C2.1 | 61.34,13.54 61.16,13.54 59.56,15.14 Q1.3 59.56,15.32 59.56,27.23 R2.2 | R7.2 57.25,27.41 59.56,27.41 R2.2 | 67.03,27.41 59.74,27.41 R2.2 | 67.03,27.41 67.92,28.3 P2.1 67.03,27.41 | 67.03,27.41 67.92,26.52 67.92,24.38 P2.2